# Altium schematic sheet ICSL_PS_MEMS_MIC_V1.SchDoc
size A
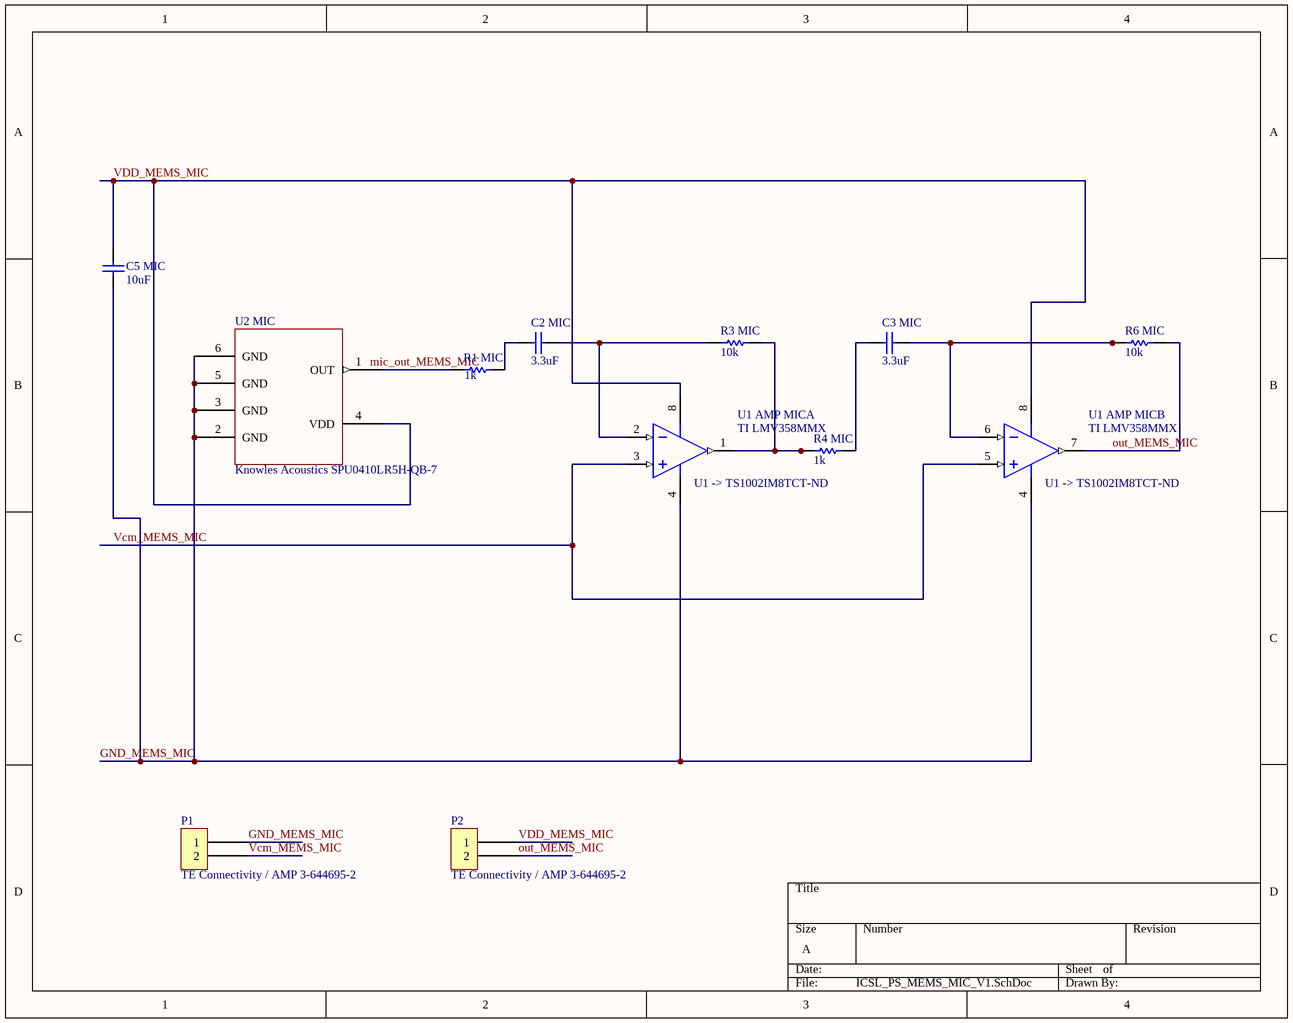
[diagram p0: ICSL_PS_MEMS_MIC_V1.SchDoc]

## Parts
C2_MIC  3.3uF  [CAPC1608X08M]
C3_MIC  3.3uF  [CAPC1608X08M]
C5_MIC  10uF  [CAPC2013X94X50LL20T25]
P1  TE Connectivity / AMP 3-644695-2  [PCB-i8m17woc8q0u0fbeoczf-1]
P2  TE Connectivity / AMP 3-644695-2  [PCB-i8m17woc8q0u0fbeoczf-1]
R1_MIC  1k  [RESC1608X06L]
R3_MIC  10k  [RESC1608X06L]
R4_MIC  1k  [RESC1608X06L]
R6_MIC  10k  [RESC1608X06L]
U1_AMP_MIC  TI LMV358MMX  [MSOP08]  (parts A,B of 2)
U2_MIC  Knowles Acoustics SPU0410LR5H-QB-7  [PCB-fhaaljglxn5h86y57i6s-1]

## Nets
GND_MEMS_MIC: C5_MIC.1 P1.1 U1_AMP_MIC.4(GND) U2_MIC.2(GND) U2_MIC.3(GND) U2_MIC.5(GND) U2_MIC.6(GND)
out_MEMS_MIC: P2.2 R6_MIC.2 U1_AMP_MIC.7(OUT2)
Vcm_MEMS_MIC: P1.2 U1_AMP_MIC.3(IN1+) U1_AMP_MIC.5(IN2+)
VDD_MEMS_MIC: C5_MIC.2 P2.1 U1_AMP_MIC.8(VCC+) U2_MIC.4(VDD)
NetC2_MIC_1: C2_MIC.1 R1_MIC.2
NetC2_MIC_2: C2_MIC.2 R3_MIC.1 U1_AMP_MIC.2(IN1-)
NetC3_MIC_1: C3_MIC.1 R4_MIC.2
NetC3_MIC_2: C3_MIC.2 R6_MIC.1 U1_AMP_MIC.6(IN2-)
NetR1_MIC_1: R1_MIC.1 U2_MIC.1(OUT)
NetR3_MIC_2: R3_MIC.2 R4_MIC.1 U1_AMP_MIC.1(OUT1)

## Notes on the sheet
- (near U1_AMP_MIC) U1 -> TS1002IM8TCT-ND
- Labels drawn without touching a wire or pin: mic_out_MEMS_MIC

## Library data of the parts
C2_MIC C3_MIC = CMP-nocyn7nhex2srcneo663-2: Generic 0603 Capacitor; Body Width: 0.8mm; CustomComponentID: nocyn7nhex2srcneo663
C5_MIC = CMP-126016-2: CAP CER 1500PF 50V 10% X7R 0805; Capacitance: 1.5e-09 F; Case/Package (SI): 2012; Lead-Free Status: Lead Free; Voltage Rating (DC): 50.0 V; Capacitance Tolerance: ±10%; Case/Package: 0805; Dielectric Characteristic: X7R; Mounting Style: Surface Mount; Number of Pins: 2; Octopart Url: https://octopart.com/08055c152kat2a-avx+interconnect+%2F+elco-40100580; OctopartID: c94f02260ecd1688; Packaging: Cut Tape (CT); REACH SVHC Compliance: No SVHC; RoHS: Compliant; Size-Height: 0.00071 m; Size-Length: 0.00201 m; Size-Width: 0.00125 m
P1 P2 = CMP-2792ecc2f21af855-6: Connector Unshrouded Header 2 Position 2.54mm Solder Straight Thru-Hole; Voltage Rating (AC): 250 V; Number of Positions: 2; Mounting Angle: 180 °; Lead-Free Status: Lead Free; Shrouded: No; ELV Compliant: Compliant; Gender: Male; Flammability Rating: UL 94 V-0; Number of Rows: 1; Housing Color: Natural; Size-Width: 2.34 mm; Mounting Style: Through Hole; Orientation: Vertical; Lifecycle Status: Active; Manufacturer Part Number: 3-644695-2; OctopartID: 2792ecc2f21af855; RoHS: Compliant; Pin Pitch: 2.54 mm; Contact Plating: Tin; Housing Material: Polyester; Size-Length: 4.80 mm; Contact Material: Copper Alloy; Size-Height: 2.54 mm; Number of Contacts: 2; Packaging: Box, Bag; Octopart URL: http://octopart.com/3-644695-2-te+connectivity+%2F+amp-39514350
R1_MIC R4_MIC = CMP-iebvg68tg8mmdpxr2n2a-5: Generic 0603 Resistor; Body Width: 0.8mm; Tolerance: 1%; Body Height: 0.45mm; Resistance: 48.7K; Body Length: 1.6mm; Package (Imperial): 0603; Package (Metric): 1608; CustomComponentID: iebvg68tg8mmdpxr2n2a
R3_MIC R6_MIC = CMP-iebvg68tg8mmdpxr2n2a-5: Generic 0603 Resistor; Body Width: 0.8mm; Tolerance: 1%; Body Height: 0.45mm; Resistance: 1.18M; Body Length: 1.6mm; Package (Imperial): 0603; Package (Metric): 1608; CustomComponentID: iebvg68tg8mmdpxr2n2a
U1_AMP_MIC = CMP-4370069-2: IC OPAMP GP 1MHZ RRO 8VSSOP; Gain Bandwidth Product: 1000000.0 Hz; Input Offset Drift: 5e-06 V/K; Lead-Free Status: Contains Lead; Number of Channels: 2; Output Current: 0.06 A; Slew Rate: 1.0 V/μs; Case/Package: MSOP; Lifecycle Status: Active; Mounting Style: Surface Mount; Number of Circuits: 2; Number of Pins: 8; Octopart Url: https://octopart.com/lmv358mmx-texas+instruments-24850535; OctopartID: a6cd6ebcb3cc790a; Packaging: Reel; RoHS: Non-Compliant
U2_MIC = CMP-9a235714badd45e4-1: Mic Mems Analog Omni -38db; Directivity: Omnidirectional; Sensitivity: -38 dbV/Pa; Acoustic Overload Point: 118 dB SPL; DC Output: 0.73 V; Output Impedance: 400 ohm; Total Harmonic Distortion: 0.15 %; Input Current to Any Pin: +- 5 mA; OUT to Ground: -0.3, Vdd +0.3; Supply Voltage: 3.6 V; Signal to Noise Ratio: 63 db(A); Vdd to Ground: -0.5, +5.0 V; Supply Current: 120 microA; Polarity: Increasing output voltage; OctopartID: 9a235714badd45e4; Temperature Range: -40 to +100 C; Octopart URL: http://octopart.com/spu0410lr5h-qb-7-knowles+acoustics-71107992; Manufacturer Part Number: SPU0410LR5H-QB-7